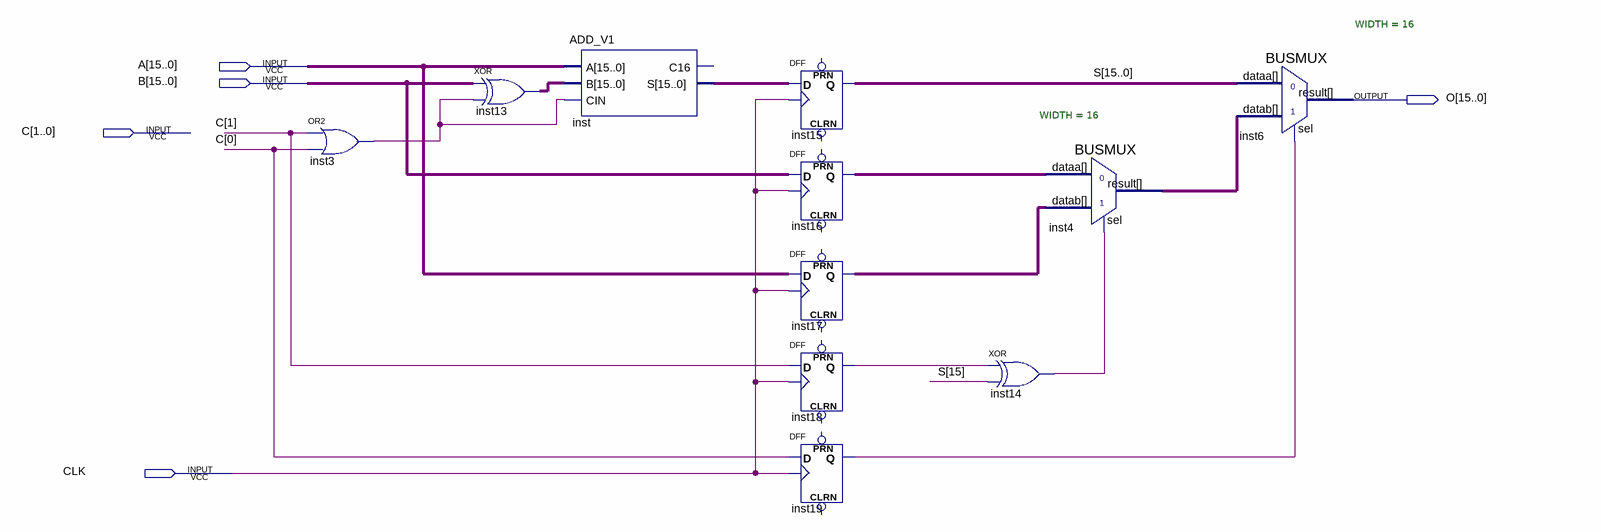
[diagram p0: schematic sheet]
// Quartus schematic ADDSUBMAX_PL.bdf as structural Verilog: 11 symbols, 5 pins
module ADDSUBMAX_PL (
  input  [15:0] A,
  input  [15:0] B,
  input  [1:0] C,
  input  CLK,
  output [15:0] O
);

  wire inst3_out, inst14_out, inst18_q, inst19_q;
  wire [15:0] inst4_result, inst13_out, inst16_q, inst17_q, inst_s, S;

  or inst3 (inst3_out, C[1], C[0]);
  assign inst13_out = B ^ {16{inst3_out}};  // XOR inst13, 16 bits wide
  ADD_V1 inst (.A(A), .B(inst13_out), .CIN(inst3_out), .S(inst_s));  // open: C16
  DFF inst15[15:0] (.CLK(CLK), .D(inst_s), .Q(S));  // open: CLRN, PRN
  DFF inst16[15:0] (.CLK(CLK), .D(B), .Q(inst16_q));  // open: CLRN, PRN
  DFF inst17[15:0] (.CLK(CLK), .D(A), .Q(inst17_q));  // open: CLRN, PRN
  DFF inst18 (.CLK(CLK), .D(C[1]), .Q(inst18_q));  // open: CLRN, PRN
  DFF inst19 (.CLK(CLK), .D(C[0]), .Q(inst19_q));  // open: CLRN, PRN
  BUSMUX #(.WIDTH(16)) inst4 (.datab(inst17_q), .sel(inst14_out), .dataa(inst16_q), .result(inst4_result));
  xor inst14 (inst14_out, inst18_q, S[15]);
  BUSMUX #(.WIDTH(16)) inst6 (.datab(inst4_result), .sel(inst19_q), .dataa(S), .result(O));
endmodule
